# Altium schematic sheet FinalSchem.SchDoc
size A4; SheetNumber: 2; SheetTotal: 2
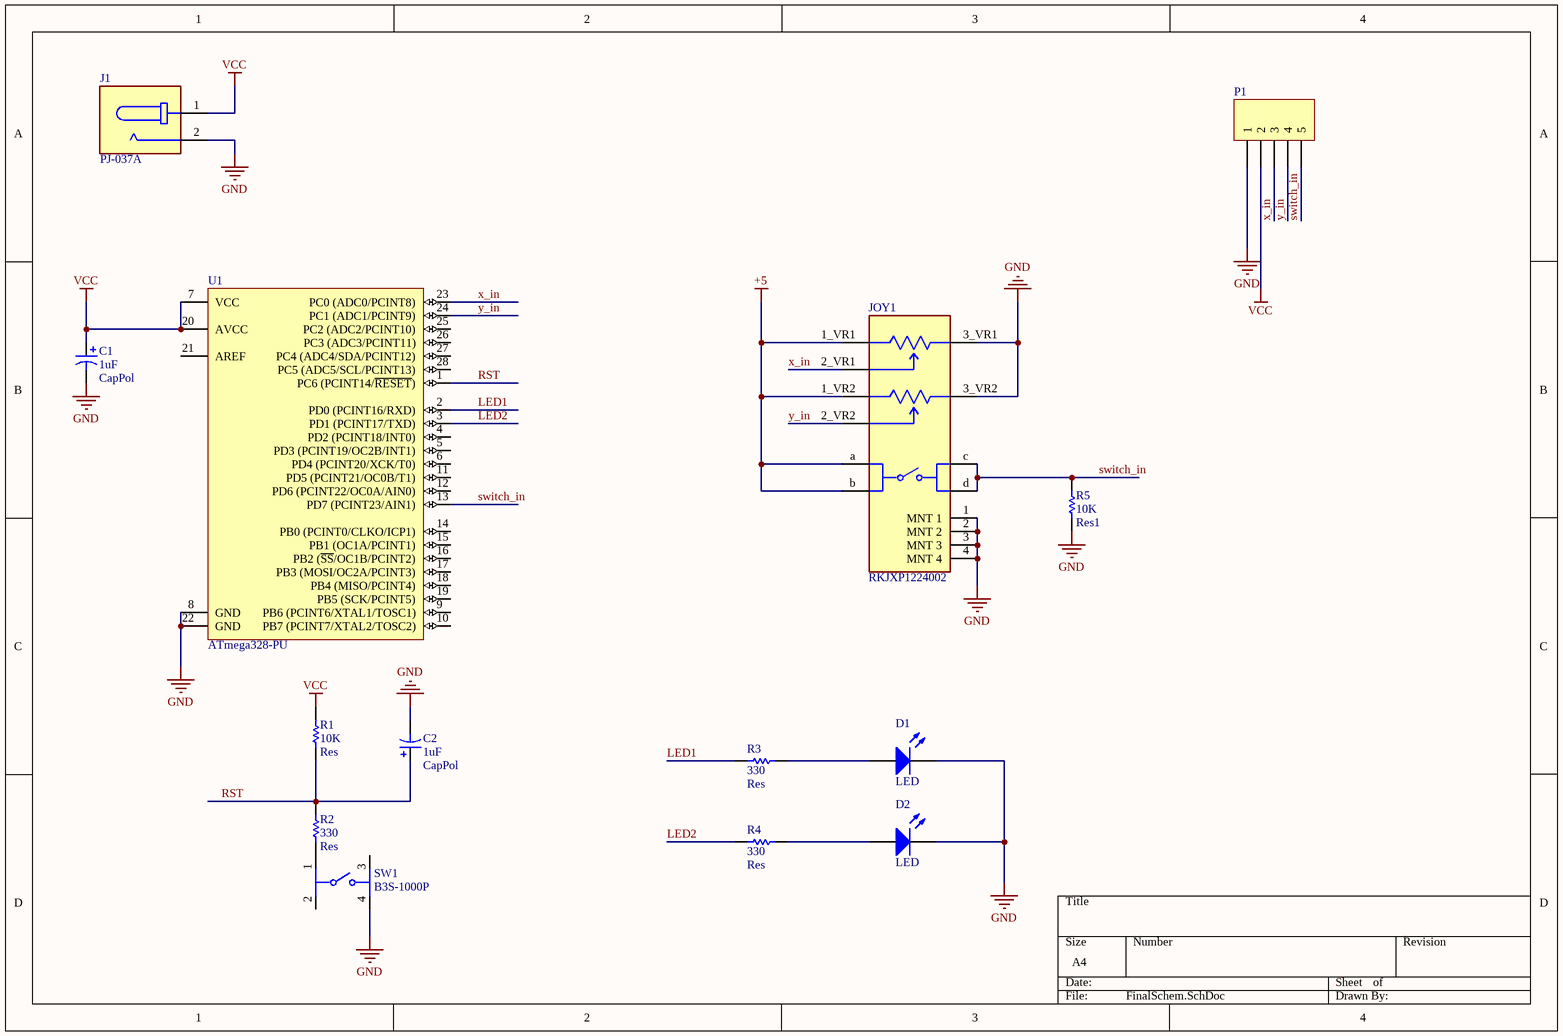
[diagram p0: FinalSchem.SchDoc]

## Parts
C1  CapPol  value 1uF  [ElectroCap]
C2  CapPol  value 1uF  [ElectroCap]
D1  LED  [LED]
D2  LED  [LED]
J1  PJ-037A  [CUI_PJ-037A]
JOY1  RKJXP1224002  [FP-RKJXP1224002-MFG]
P1  Header 5  [HDR1X5]  (value not drawn)
R1  Res  value 10K  [AXIAL-0.4]
R2  Res  value 330  [AXIAL-0.4]
R3  Res  value 330  [AXIAL-0.4]
R4  Res  value 330  [AXIAL-0.4]
R5  Res1  value 10K  [AXIAL-0.3]
SW1  B3S-1000P  [FP-B3S-1000P-MFG]
U1  ATmega328-PU  [28P3]

## Nets
+5: JOY1.1_VR1(1_VR1) JOY1.1_VR2(1_VR2) JOY1.a JOY1.b
GND: C1.2 C2.2 D1.2(K) D2.2(K) J1.2 JOY1.1(MNT_1) JOY1.2(MNT_2) JOY1.3(MNT_3) JOY1.3_VR1(3_VR1) JOY1.3_VR2(3_VR2) JOY1.4(MNT_4) P1.1 R5.1 SW1.4 U1.8(GND) U1.22(GND)
VCC: C1.1 J1.1 P1.2 R1.2 U1.7(VCC) U1.20(AVCC)
LED1: R3.2 U1.2(PD0_(PCINT16/RXD))
LED2: R4.2 U1.3(PD1_(PCINT17/TXD))
RST: C2.1 R1.1 R2.2 U1.1(PC6_(PCINT14/~{RESET}))
switch_in: JOY1.c JOY1.d P1.5 R5.2 U1.13(PD7_(PCINT23/AIN1))
x_in: JOY1.2_VR1(2_VR1) P1.3 U1.23(PC0_(ADC0/PCINT8))
y_in: JOY1.2_VR2(2_VR2) P1.4 U1.24(PC1_(ADC1/PCINT9))
NetD1_1: D1.1(A) R3.1
NetD2_1: D2.1(A) R4.1
NetR2_1: R2.1 SW1.1

Not connected (* = marked no-connect by the designer): SW1 2 3; U1 4(PD2_(PCINT18/INT0)) 5(PD3_(PCINT19/OC2B/INT1)) 6(PD4_(PCINT20/XCK/T0)) 9(PB6_(PCINT6/XTAL1/TOSC1)) 10(PB7_(PCINT7/XTAL2/TOSC2)) 11(PD5_(PCINT21/OC0B/T1)) 12(PD6_(PCINT22/OC0A/AIN0)) 14(PB0_(PCINT0/CLKO/ICP1)) 15(PB1_(OC1A/PCINT1)) 16(PB2_(~{SS}/OC1B/PCINT2)) 17(PB3_(MOSI/OC2A/PCINT3)) 18(PB4_(MISO/PCINT4)) 19(PB5_(SCK/PCINT5)) 21(AREF) 25(PC2_(ADC2/PCINT10)) 26(PC3_(ADC3/PCINT11)) 27(PC4_(ADC4/SDA/PCINT12)) 28(PC5_(ADC5/SCL/PCINT13))

## Library data of the parts
C1 C2 = CapPol: Polarized Capacitor (Axial); Published: 8-Jun-2000; LatestRevisionDate: 17-Jul-2002; LatestRevisionNote: Re-released for DXP Platform.; PackageReference: POLAR0.8; Publisher: Altium Limited; PackageDescription: Polarized Capacitor; 2 Leads
J1 = PJ-037A: MF: {'manufacturer': u'CUI'}; Package: None; Price: None; Value: *; MP: PJ-037A; Availability: Unavailable
JOY1 = CMP-24118-000004-1: Multi-Directional Switches LEVER RTRN CNTR PUSH; Power Rating: 12.5mW; Resistance: 10kR; Life (Hours): 2000Hour; Current Rating: 50mA; Resistor Type: Potentiometer; Series: RKJXP; Package Quantity: 700; Military Standard: Not; Max Operating Temperature: 70°C; Type: Potentiometer; Termination: Pin; Depth: 21.5mm; Min Operating Temperature: -10°C; Height: 12.2mm; Radiation Hardening: No; Length: 16mm; Width: 16mm; Mount: Through Hole; Packaging: Tray
P1 = Header 5: Header, 5-Pin; LatestRevisionDate: 17-Jul-2002; LatestRevisionNote: Re-released for DXP Platform.; Publisher: Altium Limited
R1-R4 = Res: Resistor; Published: 8-Jun-2000; LatestRevisionDate: 17-Jul-2002; LatestRevisionNote: Re-released for DXP Platform.; PackageReference: AXIAL-0.3; Publisher: Altium Limited; PackageDescription: Axial Device, Thru-Hole; 2 Leads; 0.3 in Pin Spacing
R5 = Res1: Resistor; Published: 8-Jun-2000; LatestRevisionDate: 17-Jul-2002; LatestRevisionNote: Re-released for DXP Platform.; PackageReference: AXIAL-0.3; Publisher: Altium Limited; PackageDescription: Axial Device, Thru-Hole; 2 Leads; 0.3 in Pin Spacing
SW1 = CMP-08834-000008-1: SWITCH TACTILE SPST-NO 0.05A 24V; Throw Configuration: SPST; Switch Function: Off-Mom; Switch Travel: 0.25mm; Contact Current Rating: 50mA; Actuator Length: 0.8mm; Mechanical Life: 500000Cycles; Contact Resistance: 100mR; Operating Force: 1.57N; Actuator Type: Standard; Illumination Type: Non-Illuminated; Ratings: IP67; Number of Poles: 1; Package Quantity: 1; Orientation: Straight; REACH SVHC: No SVHC; Lead Free: Lead Free; Max Current Rating: 50mA; Contact Plating: Silver; Current Rating: 50mA; Depth: 9mm; Contact Material: Bronze; Electrical Life: 500000Cycles; Termination: Gull Wing; Width: 6mm; Packaging: Tape and Reel; Min Operating Temperature: -25°C; Radiation Hardening: No; Max Voltage Rating (DC): 24V; Max Operating Temperature: 70°C; Length: 6.6mm; Height: 3.65mm; Voltage Rating (DC): 24V; Weight: 0.010582oz; Mount: Surface Mount
U1 = CMP-0095-00015-2: 8-bit AVR Microcontroller, 32KB Flash, 1KB EEPROM, 2KB SRAM, 28-pin PDIP, Industrial Grade (-40°C to 85°C); ComponentLink3Description: ATmega48A/48PA/88A/88PA/168A/168PA/328/328P Summary; RevisionNote: DatasheetVersion updated. URLs added.; DatasheetVersion: revD, May-2011; ComponentLink1URL: http://www.atmel.com/; PackageVersion: revB, Sep-2001; PackageDescription: 28-lead (0.300"/7.62mm Wide) Plastic Dual Inline Package (PDIP); PackageReference: 28P3; ComponentLink1Description: Manufacturer URL; ComponentLink2Description: ATmega48A/48PA/88A/88PA/168A/168PA/328/328P Datasheet; ComponentLink3URL: http://www.atmel.com/dyn/resources/prod_documents/8271S.pdf; ComponentLink2URL: http://www.atmel.com/dyn/resources/prod_documents/8271.pdf
D1 D2 = LED: Published: 8-Jun-2000; LatestRevisionDate: 08-Jul-2005; LatestRevisionNote: Mech Layer 1 removed.; PackageReference: LED-1; Publisher: Altium Limited; PackageDescription: LED; 2 Leads